# Altium schematic sheet Ticketing_Slave.SchDoc
size A4; Organization: ETML-ES; Address1: Avenue Recordon 1; Address2: 1004 Lausanne; Address3: Switzerland
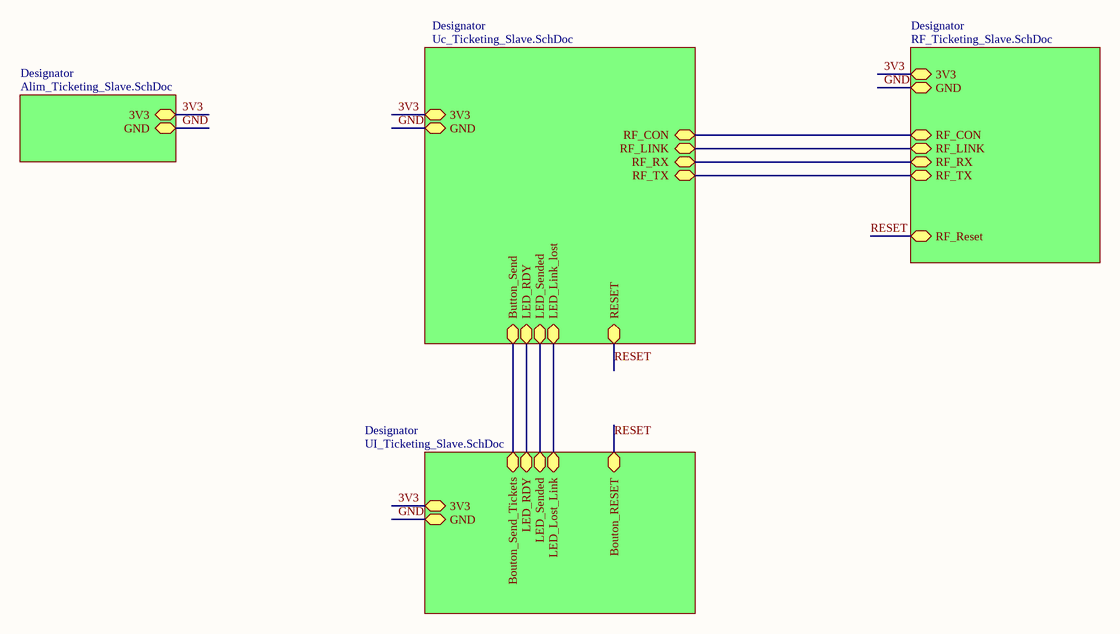
[diagram p0: Ticketing_Slave.SchDoc]

## Sub-sheets
Designator = Uc_Ticketing_Slave.SchDoc: 3V3, GND, RF_CON, RF_LINK, RF_RX, RF_TX, Button_Send, LED_Link_lost, LED_Sended, LED_RDY, RESET
Designator = RF_Ticketing_Slave.SchDoc: GND, RF_Reset, RF_CON, 3V3, RF_LINK, RF_RX, RF_TX
Designator = UI_Ticketing_Slave.SchDoc: 3V3, GND, Bouton_RESET, LED_RDY, LED_Sended, LED_Lost_Link, Bouton_Send_Tickets
Designator = Alim_Ticketing_Slave.SchDoc: GND, 3V3

## Nets
3V3: sheet Designator/3V3, sheet Designator/3V3, sheet Designator/3V3, sheet Designator/3V3
GND: sheet Designator/GND, sheet Designator/GND, sheet Designator/GND, sheet Designator/GND
RESET: sheet Designator/RESET, sheet Designator/RF_Reset, sheet Designator/Bouton_RESET
(unnamed): sheet Designator/RF_CON, sheet Designator/RF_CON
(unnamed): sheet Designator/RF_LINK, sheet Designator/RF_LINK
(unnamed): sheet Designator/RF_RX, sheet Designator/RF_RX
(unnamed): sheet Designator/RF_TX, sheet Designator/RF_TX
(unnamed): sheet Designator/Button_Send, sheet Designator/Bouton_Send_Tickets
(unnamed): sheet Designator/LED_Link_lost, sheet Designator/LED_Lost_Link
(unnamed): sheet Designator/LED_Sended, sheet Designator/LED_Sended
(unnamed): sheet Designator/LED_RDY, sheet Designator/LED_RDY

## Notes on the sheet
- Fichier :
- Date :
- Heure :
- Projet :
- Auteur :
- Version :
- Chemin :